# EAGLE design capacitive_touch_avr (EAGLE 9.0.1)
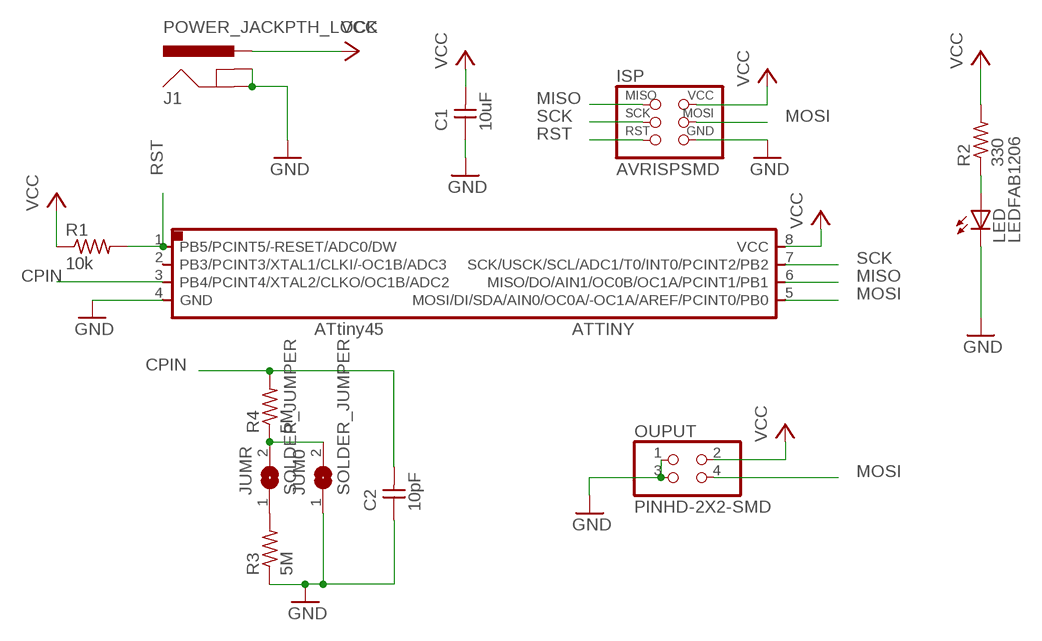
[diagram p0: schematic, sheet 1]

## Parts
ATTINY  ATTINY45SI  [SOIC8]
C1  10uF  CAP-UNPOLARIZEDFAB  [C1206FAB]
C2  10pF  CAP-UNPOLARIZEDFAB  [C1206FAB]
ISP  AVRISPSMD  [2X03SMD]
J1  POWER_JACKPTH_LOCK  [POWER_JACK_PTH_LOCK]
JUM0  SOLDER_JUMPER  [SJFAB]
JUMR  SOLDER_JUMPER  [SJFAB]
LED  LEDFAB1206  [LED1206FAB]
OUPUT  PINHD-2X2-SMD  [2X02SMD]
R1  10k  RES-US1206FAB  [R1206FAB]
R2  330  RES-US1206FAB  [R1206FAB]
R3  5M  RES-US1206FAB  [R1206FAB]
R4  5M  RES-US1206FAB  [R1206FAB]

## Nets
CPIN: ATTINY.3(PB4/PCINT4/XTAL2/CLKO/OC1B/ADC2) C2.2 R4.2
GND: ATTINY.4(GND) C1.1 C2.1 ISP.6(GND) J1.GND J1.GNDBREAK JUM0.1 LED.2(C) OUPUT.1 OUPUT.3 R3.1
MISO: ATTINY.6(MISO/DO/AIN1/OC0B/OC1A/PCINT1/PB1) ISP.1(MISO)
MOSI: ATTINY.5(MOSI/DI/SDA/AIN0/OC0A/-OC1A/AREF/PCINT0/PB0) ISP.4(MOSI) OUPUT.4
N$1: JUM0.2 JUMR.2 R4.1
N$2: JUMR.1 R3.2
N$3: LED.1(A) R2.1
RST: ATTINY.1(PB5/PCINT5/-RESET/ADC0/DW) ISP.5(RST) R1.2
SCK: ATTINY.7(SCK/USCK/SCL/ADC1/T0/INT0/PCINT2/PB2) ISP.3(SCK)
VCC: ATTINY.8(VCC) C1.2 ISP.2(VCC) J1.PWR OUPUT.2 R1.1 R2.2
Unconnected: ATTINY.2(PB3/PCINT3/XTAL1/CLKI/-OC1B/ADC3)

## Library data of the parts
ATTINY = fab:ATTINY45
C1 C2 = fab:CAP-UNPOLARIZED
ISP = fab:AVRISP
J1 = SparkFun-Connectors:POWER_JACK: Power Jack Connector This is the standard 5.5mm barrel jack for power. The PTH is the most common, proven, reliable, footprint. The Slot footprint only works if the mill layer is transmitted to the PCB fab house so be warned. Here are the connectors we sell at SparkFun: DC Barrel Power Jack/Connector <https://www.sparkfun.com/products/119> (PRT-00119) DC Barrel Power Jack/Connector (SMD) <https://www.sparkfun.com/products/12748> (PRT-12748) DC Barrel Jack Adapter - Breadboard Compatible <https://www.sparkfun.com/products/10811> (PRT-10811) It is used on this SparkFun product (and many, many others): SparkFun RedBoard - Programmed with Arduino <https://www.sparkfun.com/products/12757> (DEV-12757) Also, if you need a mating power supply or connector, please check these out: Wall Adapter Power Supply - 9VDC 650mA <https://www.sparkfun.com/products/298> (TOL-00298) DC Barrel Jack Adapter - Male <https://www.sparkfun.com/products/10287> (PRT-10287); PROD_ID: CONN-08197; SF_ID: PRT-00119
JUM0 JUMR = fab:SOLDER_JUMPER
LED = fab:LED: LED
OUPUT = fab:PINHD-2X2-SMD
R1-R4 = fab:RES-US: Resistor (US Symbol) Variants with postfix FAB are widened to allow the routing of internal traces

## Board
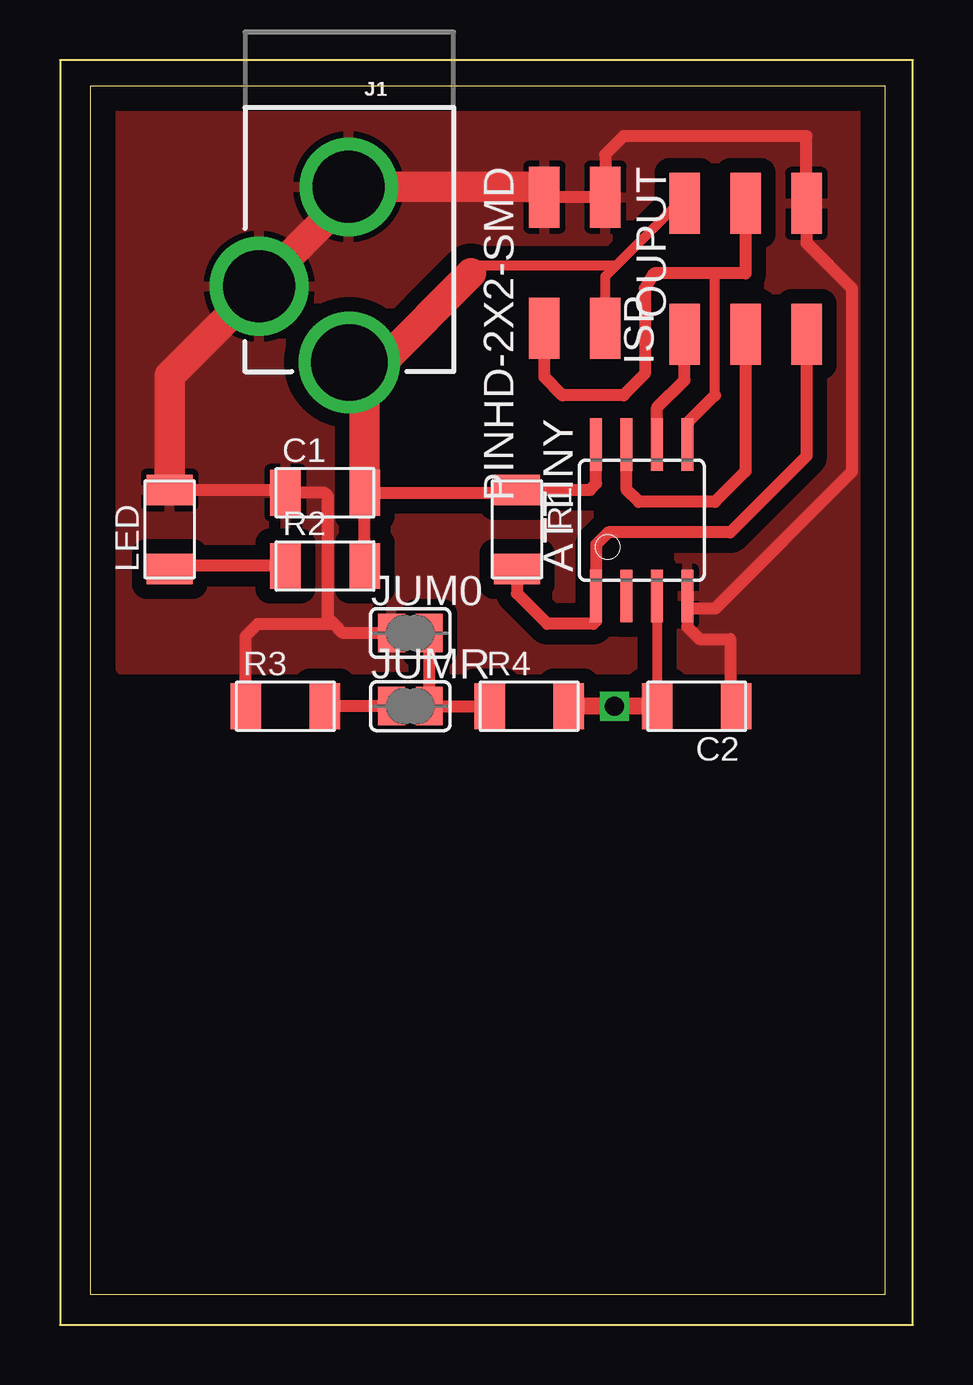
[diagram p1: board, top side]
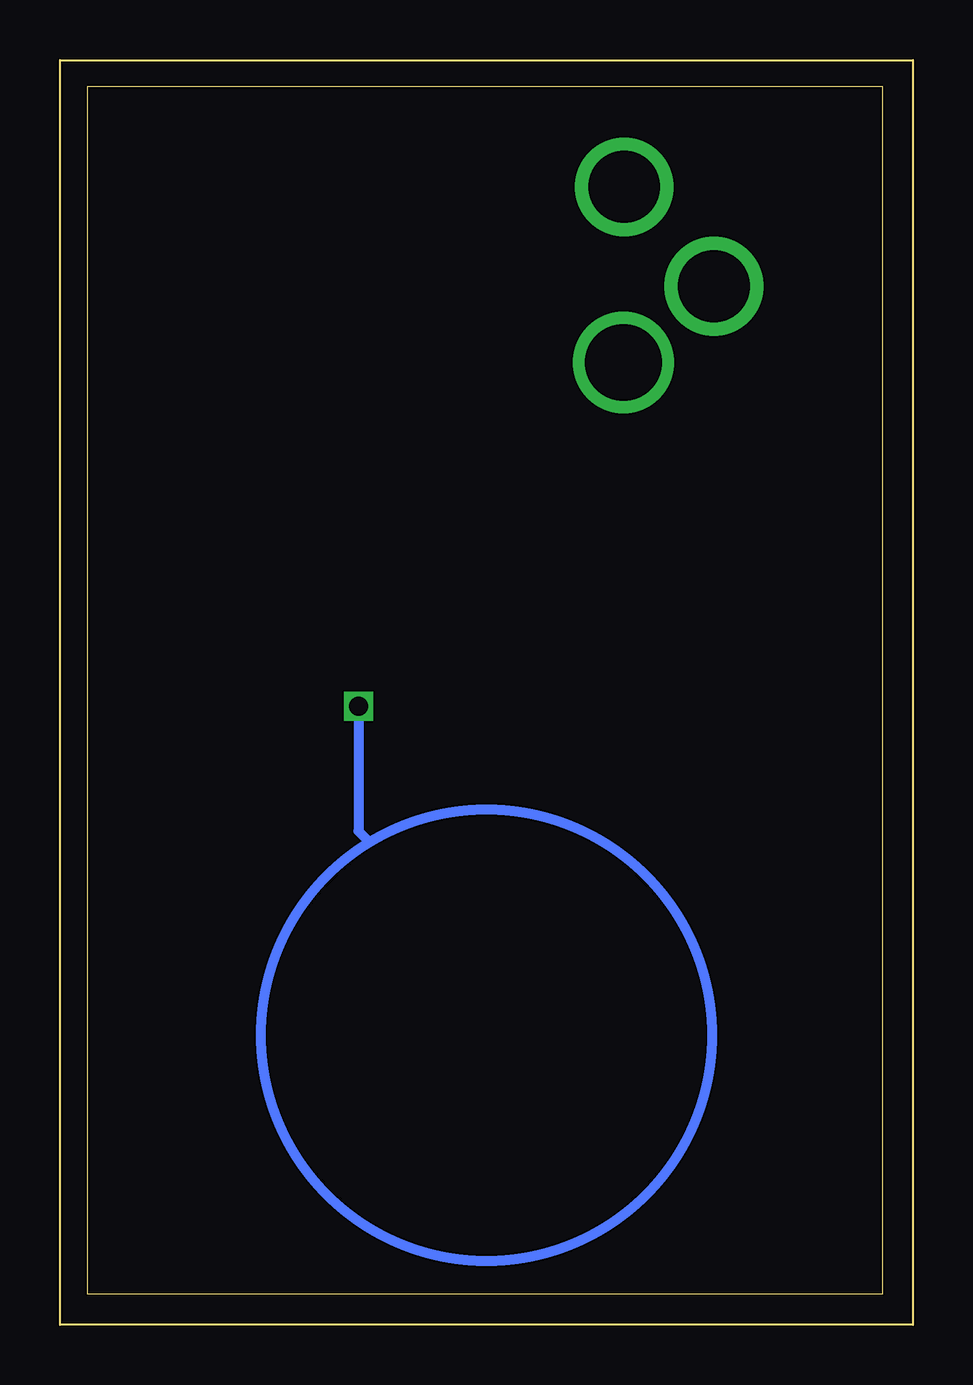
[diagram p2: board, bottom side, seen from below]

Size 35.56 x 52.71 mm. Coordinates in mm from the lower left corner, seen from the top.
Outline: 1.27,1.27 34.4,1.27 34.4,51.61 1.27,51.61 1.27,1.27
Outline: 0,0 35.56,0 35.56,52.71 0,52.71 0,0
Copper layers (1*16): Top 0.035mm / dielectric 1.5mm / Bottom 0.035mm
Design rules "default *": minimum track width 16mil, minimum drill 0.8mm, track to track 16mil, track to pad 16mil, pad to pad 16mil, via to via 16mil, smd to smd 8mil, copper to edge 40mil, drill to drill 6mil, minimum pad ring 10mil, minimum via ring 8mil, stop-mask expansion 4mil, vias tented up to drill 0mil, thermal gap 10mil

### Footprints (pad centres in the part's own frame; a part is rotated, then mirrored left to right if it is on the bottom)
SOIC8 = smd 0.5 x 2.2: 1 -1.905,-3.154; 2 -0.645,-3.154; 3 0.625,-3.154; 4 1.895,-3.154; 5 1.905,3.154; 6 0.635,3.154; 7 -0.635,3.154; 8 -1.905,3.154
C1206FAB = smd 1.27 x 1.905: 1 -1.651,0; 2 1.651,0
2X03SMD = smd 2.54 x 1.27: 1 -2.54,2.54; 2 2.92,2.54; 3 -2.54,0; 4 2.92,0; 5 -2.54,-2.54; 6 2.92,-2.54
POWER_JACK_PTH_LOCK = drill 2.997 pad 4.115: GND 0.025,6.557; GNDBREAK 3.762,10.7 | drill 3.2 pad 4.115: PWR 0,13.878
SJFAB = smd 1.118 x 1.6: 1 -0.787,0; 2 0.787,0
LED1206FAB = smd 1.27 x 1.905: 1 -1.651,0; 2 1.651,0
2X02SMD = smd 2.54 x 1.27: 1 -2.54,1.27; 2 2.92,1.27; 3 -2.54,-1.27; 4 2.92,-1.27
R1206FAB = smd 1.27 x 1.905: 1 -1.651,0; 2 1.651,0

### Placement (x,y rotation side)
ATTINY  24.26,33.53 0 top
C1  11.05,34.67 0 top
C2  26.54,25.78 180 top
ISP  28.57,43.82 90 top
J1  12.06,53.98 180 top
JUM0  14.61,28.83 0 top
JUMR  14.61,25.78 0 top
LED  4.57,33.15 90 top
OUPUT  21.46,44.45 270 top
R1  19.05,33.15 270 top
R2  11.05,31.62 0 top
R3  9.4,25.78 0 top
R4  19.56,25.78 0 top

### Tracks (layer width: path | path; a pad name or v marks a point on that pad's centre or on a via)
CPIN  (via drill 0.8)
  Top 0.406: ATTINY.3 24.88,25.79
  Top 0.508: 24.88,25.79 C2.2
  Top 0.711: C2.2 v23.11,25.78 R4.2
  Bottom 0.406: v23.11,25.78 23.11,20.57 22.73,20.19
GND
  Top 0.508: OUPUT.3 OUPUT.1 22.73,48.77 23.5,49.53 31.11,49.53 ISP.6 31.11,45.09 33.02,43.18 33.02,35.56 27.3,29.84 26.15,29.84 | LED.2 9.27,34.8 C1.1 11.05,34.67 11.18,34.54 11.18,29.46 11.43,29.21 | JUM0.1 11.81,28.83 11.43,29.21 | C2.1 27.94,26.04 27.94,28.57 26.67,28.57 26.15,29.09 26.15,29.84 | ATTINY.4 26.15,29.84 | R3.1 7.75,28.7 8.26,29.21 11.43,29.21
  Top 1.27: LED.2 4.57,39.54 J1.GNDBREAK 12.04,47.01 J1.GND 19.77,47.42 OUPUT.3
  pour Top (isolate 0.61): 2.54,50.8 33.27,50.8 33.27,27.3 2.54,27.3
MISO
  Top 0.508: ATTINY.6 24.89,38.23 26.04,39.37 ISP.1
MOSI
  Top 0.406: 27.3,38.74 27.3,43.82
  Top 0.508: ISP.4 28.57,43.82 27.3,43.82 24.77,43.82 24.38,43.18 24.38,39.62 23.5,38.74 20.95,38.74 20.19,39.5 OUPUT.4 | ATTINY.5 26.16,37.59 27.3,38.74
N$1
  Top 0.508: R4.1 JUMR.2 JUM0.2
N$2
  Top 0.508: JUMR.1 R3.2
N$3
  Top 0.508: R2.1 4.7,31.62 LED.1
RST
  Top 0.508: R1.2 19.05,30.48 20.32,29.21 22.22,29.21 22.35,29.34 ATTINY.1 22.35,32.51 22.86,33.02 27.94,33.02 31.11,36.2 ISP.5
SCK
  Top 0.508: ISP.3 28.57,35.56 27.3,34.29 24.13,34.29 23.62,34.8 ATTINY.7
VCC
  Top 0.406: OUPUT.2 22.73,43.69 23.18,44.13 | ISP.2 25.78,46.74 23.18,44.13 | 23.18,44.13 17.46,44.13 17.14,43.82
  Top 0.508: ATTINY.8 22.35,35.05 22.1,34.8 R1.1 18.92,34.67 C1.2 R2.2
  Top 1.27: C1.2 12.7,39.46 J1.PWR 13.43,40.1 17.14,43.82
(copper drawn outside any net)
  shapes: Bottom circle x1